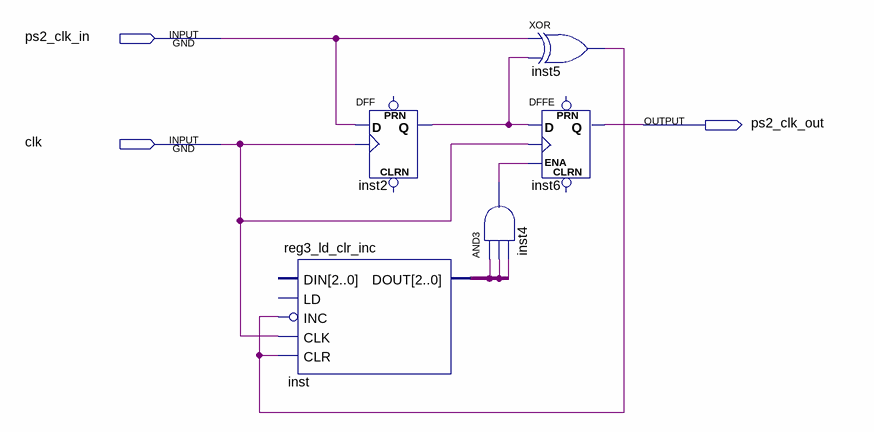
[diagram p0: schematic sheet]
// Quartus schematic ps2_dbnc.bdf as structural Verilog: 5 symbols, 3 pins
module ps2_dbnc (
  input  ps2_clk_in,
  input  clk,
  output ps2_clk_out
);

  wire inst2_q, inst4_out, inst5_out;
  wire [2:0] cnt;

  reg3_ld_clr_inc inst (.CLK(clk), .CLR(inst5_out), .INC(~inst5_out), .DOUT(cnt));  // open: DIN, LD
  DFF inst2 (.CLK(clk), .D(ps2_clk_in), .Q(inst2_q));  // open: CLRN, PRN
  and inst4 (inst4_out, cnt[2], cnt[1], cnt[0]);
  xor inst5 (inst5_out, ps2_clk_in, inst2_q);
  DFFE inst6 (.D(inst2_q), .CLK(clk), .ENA(inst4_out), .Q(ps2_clk_out));  // open: PRN, CLRN
endmodule
